# EAGLE schematic DualBalancedInput (EAGLE 6.6.0)
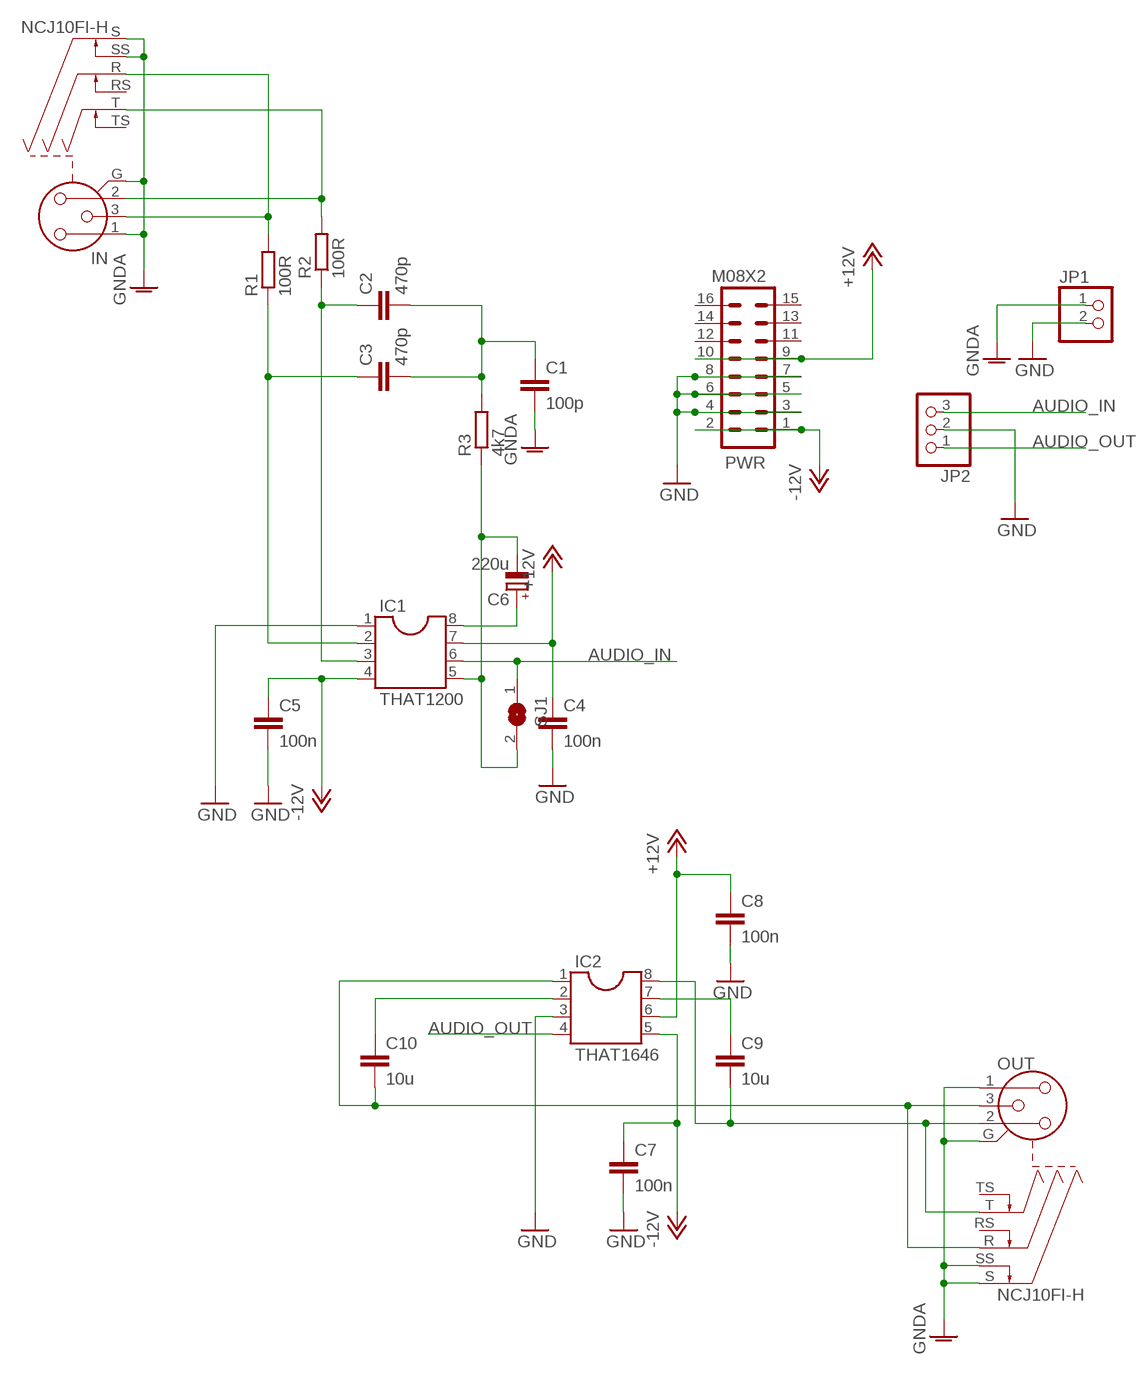
[diagram p0: schematic, sheet 1]

## Parts
C1  100p  C-EU050-025X075  [C050-025X075]
C2  470p  C-EU050-025X075  [C050-025X075]
C3  470p  C-EU050-025X075  [C050-025X075]
C4  100n  C-EU050-025X075  [C050-025X075]
C5  100n  C-EU050-025X075  [C050-025X075]
C6  220u  CPOL-EUE5-8.5  [E5-8,5]
C7  100n  C-EU050-025X075  [C050-025X075]
C8  100n  C-EU050-025X075  [C050-025X075]
C9  10u  C-EU050-025X075  [C050-025X075]
C10  10u  C-EU050-025X075  [C050-025X075]
IC1  THAT1200  DIL8  [DIL08]
IC2  THAT1646  DIL8  [DIL08]
IN  NCJ10FI-H  [NCJ10FI-H]
JP1  PINHD-1X2  [1X02]
JP2  PINHD-1X3  [1X03]
OUT  NCJ10FI-H  [NCJ10FI-H]
PWR  M08X2  [2X8]
R1  100R  R-EU_0207/7  [0207/7]
R2  100R  R-EU_0207/7  [0207/7]
R3  4k7  R-EU_0207/7  [0207/7]
SJ1  SJW  [SJW]

## Nets
+12V: C4.1 C8.1 IC1.7 IC2.6 PWR.9 PWR.10
-12V: C5.1 C7.1 IC1.4 IC2.5 PWR.1 PWR.2
AUDIO_IN: IC1.6 JP2.3 SJ1.1
AUDIO_OUT: IC2.4 JP2.1
GND: C4.2 C5.2 C7.2 C8.2 IC1.1 IC2.3 JP1.2 JP2.2 PWR.3 PWR.4 PWR.5 PWR.6 PWR.7 PWR.8
GNDA: C1.2 IN.1 IN.G IN.S IN.SS JP1.1 OUT.1 OUT.G OUT.S OUT.SS
N$1: C3.1 IC1.2 R1.1
N$3: IN.3 IN.R R1.2
N$4: C2.1 IC1.3 R2.1
N$5: IN.2 IN.T R2.2
N$6: C6.- IC1.5 R3.1 SJ1.2
N$7: C1.1 C2.2 C3.2 R3.2
N$8: C9.1 IC2.7
N$10: C10.1 IC2.2
N$13: C6.+ IC1.8
N$18: C9.2 IC2.8 OUT.2 OUT.T
N$19: C10.2 IC2.1 OUT.3 OUT.R
Unconnected: IN.RS IN.TS OUT.RS OUT.TS PWR.11 PWR.12 PWR.13 PWR.14 PWR.15 PWR.16

## Library data of the parts
C1-C5 C7-C10 = rcl:C-EU: CAPACITOR, European symbol
C6 = rcl:CPOL-EU: POLARIZED CAPACITOR, European symbol
IC1 IC2 = ic-package:DIL8: Dual In Line / Socket
IN OUT = con-neutrik_ag:NCJ10FI-: Neutrik Audio Connector XLR SERIES Stereo 1/4" jack with switch Source: www.neutrik.com/; OC_FARNELL: unknown; OC_NEWARK: unknown
JP1 = pinhead:PINHD-1X2: PIN HEADER
JP2 = pinhead:PINHD-1X3: PIN HEADER
PWR = SparkFun:M08X2
R1-R3 = rcl:R-EU_: RESISTOR, European symbol
SJ1 = jumper:SJ: SMD solder JUMPER